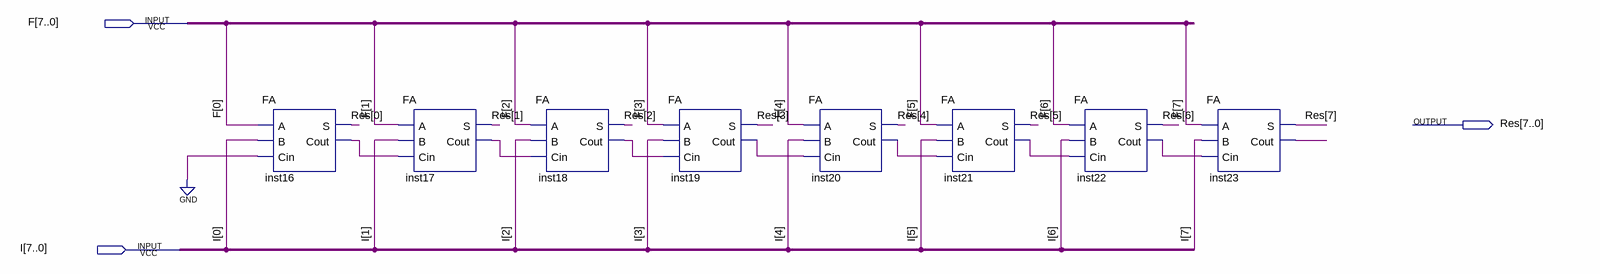
[diagram p0: schematic sheet]
// Quartus schematic ADDER_8_8_NEW.bdf as structural Verilog: 8 symbols, 3 pins
module ADDER_8_8_NEW (
  input  [7:0] F,
  input  [7:0] I,
  output [7:0] Res
);

  wire inst16_cout, inst17_cout, inst18_cout, inst19_cout, inst20_cout, inst21_cout, inst22_cout, inst23_cout;

  FA inst16 (.A(F[0]), .B(I[0]), .Cin(1'b0), .S(Res[0]), .Cout(inst16_cout));
  FA inst17 (.A(F[1]), .B(I[1]), .Cin(inst16_cout), .S(Res[1]), .Cout(inst17_cout));
  FA inst18 (.A(F[2]), .B(I[2]), .Cin(inst17_cout), .S(Res[2]), .Cout(inst18_cout));
  FA inst19 (.A(F[3]), .B(I[3]), .Cin(inst18_cout), .S(Res[3]), .Cout(inst19_cout));
  FA inst20 (.A(F[4]), .B(I[4]), .Cin(inst19_cout), .S(Res[4]), .Cout(inst20_cout));
  FA inst21 (.A(F[5]), .B(I[5]), .Cin(inst20_cout), .S(Res[5]), .Cout(inst21_cout));
  FA inst22 (.A(F[6]), .B(I[6]), .Cin(inst21_cout), .S(Res[6]), .Cout(inst22_cout));
  FA inst23 (.A(F[7]), .B(I[7]), .Cin(inst22_cout), .S(Res[7]), .Cout(inst23_cout));
endmodule
